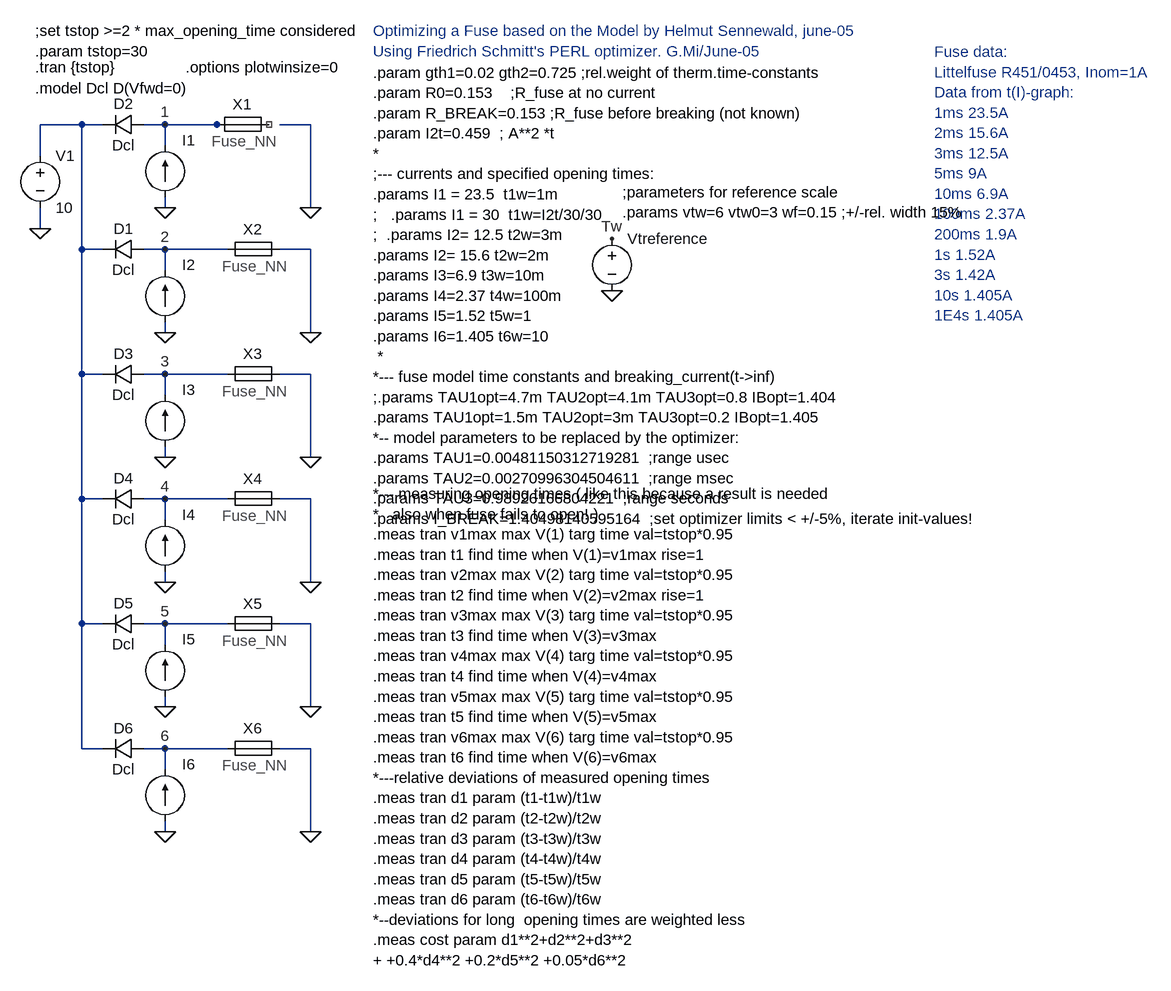
[diagram p0: schematic fuse_fit_opti.asc]
fuse_fit_opti.asc, the LTspice schematic file:
Version 4
SHEET 1 3648 932
WIRE -384 -752 -448 -752
WIRE -352 -752 -384 -752
WIRE -256 -752 -288 -752
WIRE -176 -752 -256 -752
WIRE -160 -752 -176 -752
WIRE -32 -752 -80 -752
WIRE -256 -720 -256 -752
WIRE -448 -704 -448 -752
WIRE -256 -624 -256 -640
WIRE -32 -624 -32 -752
WIRE -448 -592 -448 -624
WIRE -384 -560 -384 -752
WIRE -352 -560 -384 -560
WIRE -256 -560 -288 -560
WIRE -160 -560 -256 -560
WIRE -32 -560 -80 -560
WIRE -256 -528 -256 -560
WIRE -256 -432 -256 -448
WIRE -32 -432 -32 -560
WIRE -384 -368 -384 -560
WIRE -352 -368 -384 -368
WIRE -256 -368 -288 -368
WIRE -160 -368 -256 -368
WIRE -32 -368 -80 -368
WIRE -256 -336 -256 -368
WIRE -256 -240 -256 -256
WIRE -32 -240 -32 -368
WIRE -384 -176 -384 -368
WIRE -352 -176 -384 -176
WIRE -256 -176 -288 -176
WIRE -160 -176 -256 -176
WIRE -32 -176 -80 -176
WIRE -256 -144 -256 -176
WIRE -256 -48 -256 -64
WIRE -32 -48 -32 -176
WIRE -384 16 -384 -176
WIRE -352 16 -384 16
WIRE -256 16 -288 16
WIRE -160 16 -256 16
WIRE -32 16 -80 16
WIRE -256 48 -256 16
WIRE -256 144 -256 128
WIRE -32 144 -32 16
WIRE -384 208 -384 16
WIRE -352 208 -384 208
WIRE -256 208 -288 208
WIRE -160 208 -256 208
WIRE -32 208 -80 208
WIRE -256 240 -256 208
WIRE -256 336 -256 320
WIRE -32 336 -32 208
FLAG -256 -624 0
FLAG -256 -752 1
FLAG -32 -624 0
FLAG -448 -592 0
FLAG -256 -432 0
FLAG -256 -560 2
FLAG -32 -432 0
FLAG -256 -240 0
FLAG -256 -368 3
FLAG -32 -240 0
FLAG -256 -48 0
FLAG -256 -176 4
FLAG -32 -48 0
FLAG -256 144 0
FLAG -256 16 5
FLAG -32 144 0
FLAG -256 336 0
FLAG -256 208 6
FLAG -32 336 0
FLAG 432 -496 0
FLAG 432 -576 Tw
SYMBOL diode -288 -768 R90
WINDOW 0 0 32 VBottom 0
WINDOW 3 32 32 VTop 0
SYMATTR InstName D2
SYMATTR Value Dcl
SYMBOL voltage -448 -720 R0
WINDOW 123 0 0 Left 0
WINDOW 39 0 0 Left 0
SYMATTR InstName V1
SYMATTR Value 10
SYMBOL diode -288 -576 R90
WINDOW 0 0 32 VBottom 0
WINDOW 3 32 32 VTop 0
SYMATTR InstName D1
SYMATTR Value Dcl
SYMBOL diode -288 -384 R90
WINDOW 0 0 32 VBottom 0
WINDOW 3 32 32 VTop 0
SYMATTR InstName D3
SYMATTR Value Dcl
SYMBOL diode -288 -192 R90
WINDOW 0 0 32 VBottom 0
WINDOW 3 32 32 VTop 0
SYMATTR InstName D4
SYMATTR Value Dcl
SYMBOL diode -288 0 R90
WINDOW 0 0 32 VBottom 0
WINDOW 3 32 32 VTop 0
SYMATTR InstName D5
SYMATTR Value Dcl
SYMBOL diode -288 192 R90
WINDOW 0 0 32 VBottom 0
WINDOW 3 32 32 VTop 0
SYMATTR InstName D6
SYMATTR Value Dcl
SYMBOL voltage 432 -592 R0
WINDOW 3 26 87 Invisible 0
WINDOW 123 0 0 Left 0
WINDOW 39 0 0 Left 0
SYMATTR Value PWL(0 {vtw0} {t1w-t1w*wf} {vtw0} {t1w} {vtw} {t1w+t1w*wf} {vtw0} {t2w-t2w*wf} {vtw0} {t2w} {vtw} {t2w+t2w*wf} {vtw0} {t3w-t3w*wf} {vtw0} {t3w} {vtw} {t3w+t3w*wf} {vtw0} {t4w-t4w*wf} {vtw0} {t4w} {vtw} {t4w+t4w*wf} {vtw0} {t5w-t5w*wf} {vtw0} {t5w} {vtw} {t5w+t5w*wf} {vtw0} {t6w-t6w*wf} {vtw0} {t6w} {vtw} {t6w+t6w*wf} {vtw0})
SYMATTR InstName Vtreference
SYMBOL current -256 -448 R180
WINDOW 0 -47 88 Left 0
WINDOW 3 -82 39 Invisible 0
WINDOW 123 0 0 Left 0
WINDOW 39 0 0 Left 0
SYMATTR InstName I2
SYMATTR Value {I2}
SYMBOL current -256 -256 R180
WINDOW 0 -47 88 Left 0
WINDOW 3 -82 39 Invisible 0
WINDOW 123 0 0 Left 0
WINDOW 39 0 0 Left 0
SYMATTR InstName I3
SYMATTR Value {I3}
SYMBOL current -256 -64 R180
WINDOW 0 -47 88 Left 0
WINDOW 3 -82 39 Invisible 0
WINDOW 123 0 0 Left 0
WINDOW 39 0 0 Left 0
SYMATTR InstName I4
SYMATTR Value {I4}
SYMBOL current -256 128 R180
WINDOW 0 -47 88 Left 0
WINDOW 3 -82 39 Invisible 0
WINDOW 123 0 0 Left 0
WINDOW 39 0 0 Left 0
SYMATTR InstName I5
SYMATTR Value {I5}
SYMBOL current -256 320 R180
WINDOW 0 -47 88 Left 0
WINDOW 3 -82 39 Invisible 0
WINDOW 123 0 0 Left 0
WINDOW 39 0 0 Left 0
SYMATTR InstName I6
SYMATTR Value PULSE(0 {I6} 0 1n 1n 1E6)
SYMBOL current -256 -640 R180
WINDOW 0 -47 88 Left 0
WINDOW 3 -82 39 Invisible 0
WINDOW 123 0 0 Left 0
WINDOW 39 0 0 Left 0
SYMATTR InstName I1
SYMATTR Value {I1}
SYMBOL Fuse_Model_NN -144 -752 R0
SYMATTR InstName X1
SYMBOL Fuse_Model_NN -128 -560 R0
SYMATTR InstName X2
SYMBOL Fuse_Model_NN -128 -368 R0
SYMATTR InstName X3
SYMBOL Fuse_Model_NN -128 -176 R0
SYMATTR InstName X4
SYMBOL Fuse_Model_NN -128 16 R0
SYMATTR InstName X5
SYMBOL Fuse_Model_NN -128 208 R0
SYMATTR InstName X6
TEXT -456 -840 Left 0 !.tran {tstop}
TEXT -224 -840 Left 0 !.options plotwinsize=0
TEXT 64 -832 Left 0 !.param gth1=0.02 gth2=0.725 ;rel.weight of therm.time-constants\n.param R0=0.153    ;R_fuse at no current\n.param R_BREAK=0.153 ;R_fuse before breaking (not known)\n.param I2t=0.459  ; A**2 *t\n*\n;--- currents and specified opening times:\n.params I1 = 23.5  t1w=1m\n;   .params I1 = 30  t1w=I2t/30/30\n;  .params I2= 12.5 t2w=3m\n.params I2= 15.6 t2w=2m\n.params I3=6.9 t3w=10m\n.params I4=2.37 t4w=100m\n.params I5=1.52 t5w=1\n.params I6=1.405 t6w=10\n *\n*--- fuse model time constants and breaking_current(t->inf)\n;.params TAU1opt=4.7m TAU2opt=4.1m TAU3opt=0.8 IBopt=1.404\n.params TAU1opt=1.5m TAU2opt=3m TAU3opt=0.2 IBopt=1.405\n*-- model parameters to be replaced by the optimizer:\n.params TAU1=0.00481150312719281  ;range usec\n.params TAU2=0.00270996304504611  ;range msec\n.params TAU3=0.98926166804221  ;range seconds\n.params I_BREAK=1.40498140595164  ;set optimizer limits < +/-5%, iterate init-values!
TEXT 64 -184 Left 0 !*--- measuring opening times ( like this because a result is needed\n*   also when fuse fails to open! )\n.meas tran v1max max V(1) targ time val=tstop*0.95\n.meas tran t1 find time when V(1)=v1max rise=1\n.meas tran v2max max V(2) targ time val=tstop*0.95\n.meas tran t2 find time when V(2)=v2max rise=1\n.meas tran v3max max V(3) targ time val=tstop*0.95\n.meas tran t3 find time when V(3)=v3max\n.meas tran v4max max V(4) targ time val=tstop*0.95\n.meas tran t4 find time when V(4)=v4max\n.meas tran v5max max V(5) targ time val=tstop*0.95\n.meas tran t5 find time when V(5)=v5max\n.meas tran v6max max V(6) targ time val=tstop*0.95\n.meas tran t6 find time when V(6)=v6max\n*---relative deviations of measured opening times\n.meas tran d1 param (t1-t1w)/t1w\n.meas tran d2 param (t2-t2w)/t2w\n.meas tran d3 param (t3-t3w)/t3w\n.meas tran d4 param (t4-t4w)/t4w\n.meas tran d5 param (t5-t5w)/t5w\n.meas tran d6 param (t6-t6w)/t6w\n*--deviations for long  opening times are weighted less\n.meas cost param d1**2+d2**2+d3**2\n+ +0.4*d4**2 +0.2*d5**2 +0.05*d6**2
TEXT -456 -808 Left 0 !.model Dcl D(Vfwd=0)
TEXT -456 -896 Left 0 !;set tstop >=2 * max_opening_time considered\n.param tstop=30
TEXT 928 -864 Left 0 ;Fuse data:\nLittelfuse R451/0453, Inom=1A\nData from t(I)-graph:\n1ms 23.5A\n2ms 15.6A\n3ms 12.5A\n5ms 9A\n10ms 6.9A\n100ms 2.37A\n200ms 1.9A\n1s 1.52A\n3s 1.42A\n10s 1.405A\n1E4s 1.405A
TEXT 64 -896 Left 0 ;Optimizing a Fuse based on the Model by Helmut Sennewald, june-05\nUsing Friedrich Schmitt's PERL optimizer. G.Mi/June-05
TEXT 448 -648 Left 0 !;parameters for reference scale\n.params vtw=6 vtw0=3 wf=0.15 ;+/-rel. width 15%

The netlist it stands for:
* fuse_fit_opti.asc
D2 1 N001 Dcl
V1 N001 0 10
D1 2 N001 Dcl
D3 3 N001 Dcl
D4 4 N001 Dcl
D5 5 N001 Dcl
D6 6 N001 Dcl
Vtreference Tw 0 PWL(0 {vtw0} {t1w-t1w*wf} {vtw0} {t1w} {vtw} {t1w+t1w*wf} {vtw0} {t2w-t2w*wf} {vtw0} {t2w} {vtw} {t2w+t2w*wf} {vtw0} {t3w-t3w*wf} {vtw0} {t3w} {vtw} {t3w+t3w*wf} {vtw0} {t4w-t4w*wf} {vtw0} {t4w} {vtw} {t4w+t4w*wf} {vtw0} {t5w-t5w*wf} {vtw0} {t5w} {vtw} {t5w+t5w*wf} {vtw0} {t6w-t6w*wf} {vtw0} {t6w} {vtw} {t6w+t6w*wf} {vtw0})
I2 0 2 {I2}
I3 0 3 {I3}
I4 0 4 {I4}
I5 0 5 {I5}
I6 0 6 PULSE(0 {I6} 0 1n 1n 1E6)
I1 0 1 {I1}
XX1 1 NC_01 Fuse_Model_NN  ; pins A B
XX2 2 0 Fuse_Model_NN  ; pins A B
XX3 3 0 Fuse_Model_NN  ; pins A B
XX4 4 0 Fuse_Model_NN  ; pins A B
XX5 5 0 Fuse_Model_NN  ; pins A B
XX6 6 0 Fuse_Model_NN  ; pins A B
.model D D
.lib standard.dio
.tran {tstop}
.options plotwinsize=0
.param gth1=0.02 gth2=0.725 ;rel.weight of therm.time-constants
.param R0=0.153    ;R_fuse at no current
.param R_BREAK=0.153 ;R_fuse before breaking (not known)
.param I2t=0.459  ; A**2 *t
*
;--- currents and specified opening times:
.params I1 = 23.5  t1w=1m
;   .params I1 = 30  t1w=I2t/30/30
;  .params I2= 12.5 t2w=3m
.params I2= 15.6 t2w=2m
.params I3=6.9 t3w=10m
.params I4=2.37 t4w=100m
.params I5=1.52 t5w=1
.params I6=1.405 t6w=10
 *
*--- fuse model time constants and breaking_current(t->inf)
;.params TAU1opt=4.7m TAU2opt=4.1m TAU3opt=0.8 IBopt=1.404
.params TAU1opt=1.5m TAU2opt=3m TAU3opt=0.2 IBopt=1.405
*-- model parameters to be replaced by the optimizer:
.params TAU1=0.00481150312719281  ;range usec
.params TAU2=0.00270996304504611  ;range msec
.params TAU3=0.98926166804221  ;range seconds
.params I_BREAK=1.40498140595164  ;set optimizer limits < +/-5%, iterate init-values!
*--- measuring opening times ( like this because a result is needed
*   also when fuse fails to open! )
.meas tran v1max max V(1) targ time val=tstop*0.95
.meas tran t1 find time when V(1)=v1max rise=1
.meas tran v2max max V(2) targ time val=tstop*0.95
.meas tran t2 find time when V(2)=v2max rise=1
.meas tran v3max max V(3) targ time val=tstop*0.95
.meas tran t3 find time when V(3)=v3max
.meas tran v4max max V(4) targ time val=tstop*0.95
.meas tran t4 find time when V(4)=v4max
.meas tran v5max max V(5) targ time val=tstop*0.95
.meas tran t5 find time when V(5)=v5max
.meas tran v6max max V(6) targ time val=tstop*0.95
.meas tran t6 find time when V(6)=v6max
*---relative deviations of measured opening times
.meas tran d1 param (t1-t1w)/t1w
.meas tran d2 param (t2-t2w)/t2w
.meas tran d3 param (t3-t3w)/t3w
.meas tran d4 param (t4-t4w)/t4w
.meas tran d5 param (t5-t5w)/t5w
.meas tran d6 param (t6-t6w)/t6w
*--deviations for long  opening times are weighted less
.meas cost param d1**2+d2**2+d3**2
+ +0.4*d4**2 +0.2*d5**2 +0.05*d6**2
.model Dcl D(Vfwd=0)
;set tstop >=2 * max_opening_time considered
.param tstop=30
* Fuse data:
* Littelfuse R451/0453, Inom=1A
* Data from t(I)-graph:
* 1ms 23.5A
* 2ms 15.6A
* 3ms 12.5A
* 5ms 9A
* 10ms 6.9A
* 100ms 2.37A
* 200ms 1.9A
* 1s 1.52A
* 3s 1.42A
* 10s 1.405A
* 1E4s 1.405A
* Optimizing a Fuse based on the Model by Helmut Sennewald, june-05
* Using Friedrich Schmitt's PERL optimizer. G.Mi/June-05
;parameters for reference scale
.params vtw=6 vtw0=3 wf=0.15 ;+/-rel. width 15%
.backanno
.end